# Altium schematic sheet DAC_Interface.SchDoc
size A3; PageSetup: Record=PageOptions|CenterHorizontal=True|CenterVertical=True|PrintScale=0.71|XCorrection=1.00|YCorrection=1.00|PrintKind=0|BorderSize=5000000|LeftOffset=0|BottomOffset=0|Orientation=2|PaperLength=1000|PaperWidth=1000|Scale=100|PaperSource=7|PrintQuality=-4|MediaType=1|DitherType=10|PaperKind=A4|PrintScaleMode=1; Date: 27.05.2014; DrawnBy: luths8; Organization: BFH; Address1: Bern University of Applied Sciences; Address2: Engineering and Information Technology; Address3: Jlcoweg 1; Address4: CH-3400 Burgdorf; DocumentNumber: 16; Revision: 1.1; SheetNumber: 16; SheetTotal: 16; CurrentDate: 27.05.2014
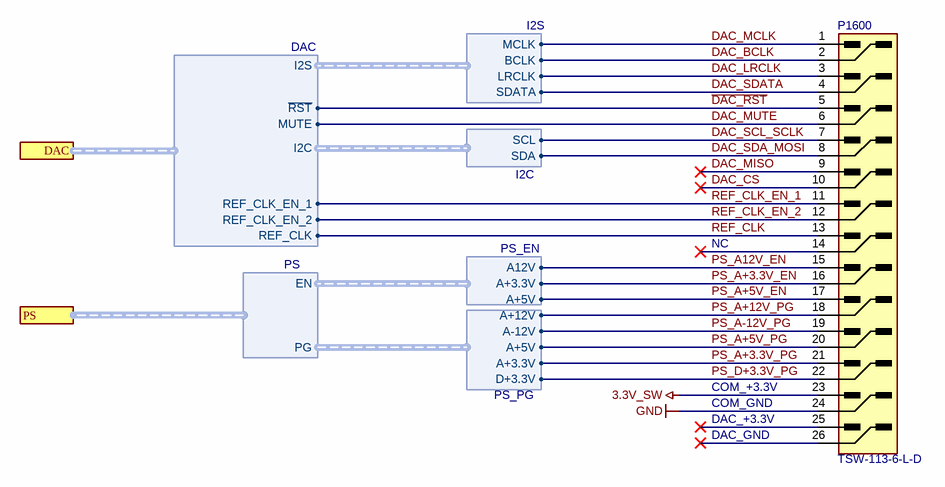
[diagram p0: DAC_Interface.SchDoc]

## Parts
P1600  TSW-113-6-L-D  [HEADER_2x13P_VERTICAL]

## Ports
DAC (harness DAC), PS (harness PS)

## Harnesses
PS: EN, PG
PS_EN: A12V, A+3.3V, A+5V
PS_PG: A+12V, A-12V, A+3.3V, A+5V, D+3.3V
DAC: I2S, ~{RST}, I2C, MUTE, REF_CLK_EN_1, REF_CLK_EN_2, REF_CLK
I2S: MCLK, BCLK, LRCLK, SDATA
I2C: SCL, SDA

## Nets
3.3V_SW: P1600.23
GND: P1600.24
~{DAC_RST}: P1600.5 ; port DAC.~{RST}
DAC_BCLK: P1600.2 ; harness I2S.BCLK
DAC_CS: P1600.10
DAC_LRCLK: P1600.3 ; harness I2S.LRCLK
DAC_MCLK: P1600.1 ; harness I2S.MCLK
DAC_MISO: P1600.9
DAC_MUTE: P1600.6 ; port DAC.MUTE
DAC_SCL_SCLK: P1600.7 ; harness I2C.SCL
DAC_SDA_MOSI: P1600.8 ; harness I2C.SDA
DAC_SDATA: P1600.4 ; harness I2S.SDATA
PS_A12V_EN: P1600.15 ; harness PS_EN.A12V
PS_A+3.3V_EN: P1600.16 ; harness PS_EN.A+3.3V
PS_A+3.3V_PG: P1600.21 ; harness PS_PG.A+3.3V
PS_A+5V_EN: P1600.17 ; harness PS_EN.A+5V
PS_A+5V_PG: P1600.20 ; harness PS_PG.A+5V
PS_A+12V_PG: P1600.18 ; harness PS_PG.A+12V
PS_A-12V_PG: P1600.19 ; harness PS_PG.A-12V
PS_D+3.3V_PG: P1600.22 ; harness PS_PG.D+3.3V
REF_CLK: P1600.13 ; port DAC.REF_CLK
REF_CLK_EN_1: P1600.11 ; port DAC.REF_CLK_EN_1
REF_CLK_EN_2: P1600.12 ; port DAC.REF_CLK_EN_2

Not connected (* = marked no-connect by the designer): P1600 14* 25* 26*

## Notes on the sheet
- NC
- COM_+3.3V
- COM_GND
- DAC_GND
- DAC_+3.3V
- Project:
- Size:
- Sheet:
- Title:
- A3
- of
- Drawn by:
- Revision:
- Date:
- Variant:
- b
- File:

## Library data of the parts
P1600 = Header 13x2P: Manufacturer Part No.: TSW-113-6-L-D